# EAGLE design stm32g030c8t6 (EAGLE 9.6.1)
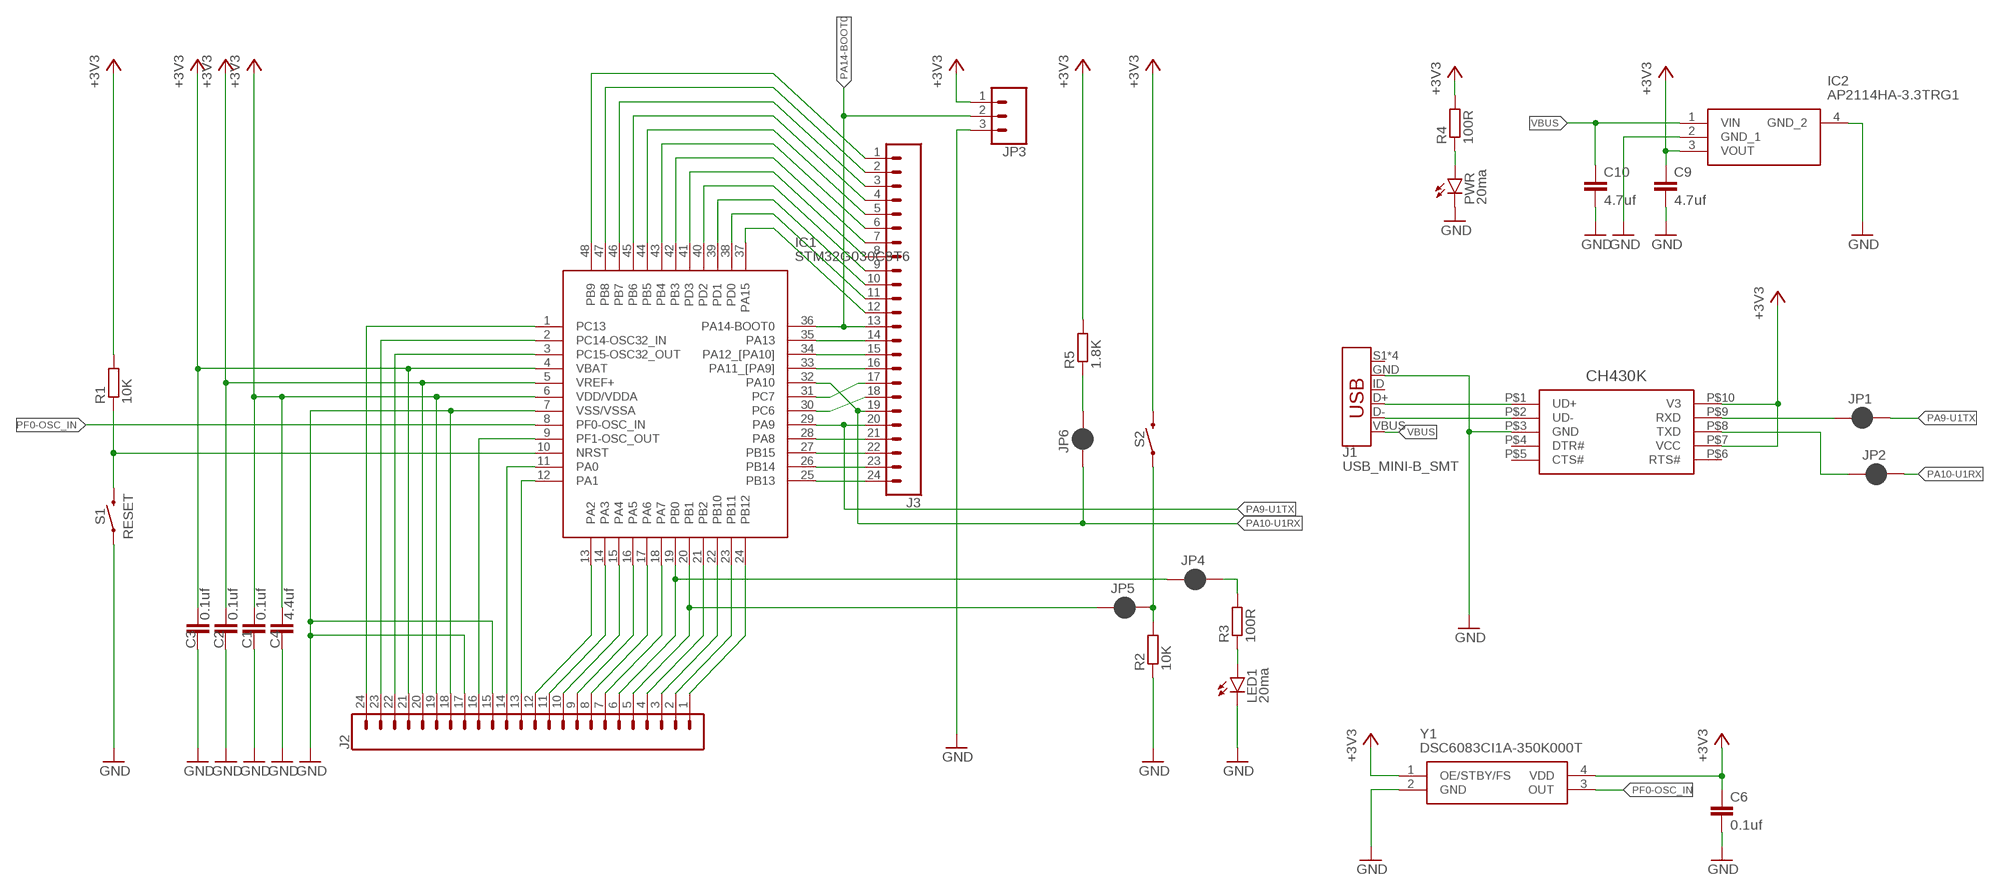
[diagram p0: schematic, sheet 1]

## Parts
C1  0.1uf  C-EUC0805  [C0805]
C2  0.1uf  C-EUC0805  [C0805]
C3  0.1uf  C-EUC0805  [C0805]
C4  4.4uf  C-EUC0805  [C0805]
C6  0.1uf  C-EUC0805  [C0805]
C9  4.7uf  C-EUC1206  [C1206]
C10  4.7uf  C-EUC1206  [C1206]
IC1  STM32G030C8T6  [QFP50P900X900X160-48N]
IC2  AP2114HA-3.3TRG1  [SOT230P700X180-4N]
J1  USB_MINI-B_SMT  [USB-MINIB]
J2  CONN_24  [1X24]
J3  CONN_24  [1X24]
JP1  JUMPER-SMT_2_NC_PASTE_SILK  [SMT-JUMPER_2_NC_PASTE_SILK]
JP2  JUMPER-SMT_2_NC_PASTE_SILK  [SMT-JUMPER_2_NC_PASTE_SILK]
JP3  455-1750-1-ND  CONN_03  [1X03]
JP4  JUMPER-SMT_2_NC_PASTE_SILK  [SMT-JUMPER_2_NC_PASTE_SILK]
JP5  JUMPER-SMT_2_NC_PASTE_SILK  [SMT-JUMPER_2_NC_PASTE_SILK]
JP6  JUMPER-SMT_2_NC_PASTE_SILK  [SMT-JUMPER_2_NC_PASTE_SILK]
LED1  20ma  LEDSML0805  [SML0805]
PWR  20ma  LEDSML0805  [SML0805]
R1  10K  R-EU_R0805  [R0805]
R2  10K  R-EU_R0805  [R0805]
R3  100R  R-EU_R0805  [R0805]
R4  100R  R-EU_R0805  [R0805]
R5  1.8K  R-EU_R0805  [R0805]
S1  RESET  MOMENTARY-SWITCH-SPST-SMD-6.0X3.5MM  [TACTILE_SWITCH_SMD_6.0X3.5MM]
S2  RESET  MOMENTARY-SWITCH-SPST-SMD-6.0X3.5MM  [TACTILE_SWITCH_SMD_6.0X3.5MM]
U$1  CH430K  [ESSOP-10]
Y1  DSC6083CI1A-350K000T  [DSC6083CI1A350K000T]

## Nets
+3V3: C1.1 C2.1 C3.1 C4.1 C6.1 C9.1 IC1.4(VBAT) IC1.5(VREF+) IC1.6(VDD/VDDA) IC2.3(VOUT) J2.19 J2.20 J2.21 JP3.1 R1.2 R4.2 R5.2 S2.2 U$1.P$7(VCC) U$1.P$10(V3) Y1.1(OE/STBY/FS) Y1.4(VDD)
A0: IC1.11(PA0) J2.14
A1: IC1.12(PA1) J2.13
A2: IC1.13(PA2) J2.12
A3: IC1.14(PA3) J2.11
A4: IC1.15(PA4) J2.10
A5: IC1.16(PA5) J2.9
A6: IC1.17(PA6) J2.8
A7: IC1.18(PA7) J2.7
B0: IC1.19(PB0) J2.6 JP4.1
B1: IC1.20(PB1) J2.5 JP5.1
B2: IC1.21(PB2) J2.4
B10: IC1.22(PB10) J2.3
B11: IC1.23(PB11) J2.2
B12: IC1.24(PB12) J2.1
GND: C1.2 C2.2 C3.2 C4.2 C6.2 C9.2 C10.2 IC1.7(VSS/VSSA) IC2.2(GND_1) IC2.4(GND_2) J1.GND J2.15 J2.17 J2.18 JP3.3 LED1.C PWR.C R2.1 S1.1 U$1.P$3(GND) Y1.2(GND)
N$1: JP6.2 R5.1
N$2 [logic]: LED1.A R3.1
N$3: JP4.2 R3.2
N$4: JP5.2 R2.2 S2.1
N$6 [logic]: PWR.A R4.1
PA8: IC1.28(PA8) J3.21
PA9-U1TX: IC1.29(PA9) J3.20 JP1.2
PA10-U1RX: IC1.32(PA10) J3.19 JP2.2 JP6.1
PA11: IC1.33(PA11_[PA9]) J3.16
PA12: IC1.34(PA12_[PA10]) J3.15
PA13: IC1.35(PA13) J3.14
PA14-BOOT0: IC1.36(PA14-BOOT0) J3.13 JP3.2
PA15: IC1.37(PA15) J3.12
PB3: IC1.42(PB3) J3.7
PB4: IC1.43(PB4) J3.6
PB5: IC1.44(PB5) J3.5
PB6: IC1.45(PB6) J3.4
PB7: IC1.46(PB7) J3.3
PB8: IC1.47(PB8) J3.2
PB9: IC1.48(PB9) J3.1
PB13: IC1.25(PB13) J3.24
PB14: IC1.26(PB14) J3.23
PB15: IC1.27(PB15) J3.22
PC6: IC1.30(PC6) J3.18
PC7: IC1.31(PC7) J3.17
PC13: IC1.1(PC13) J2.24
PC14: IC1.2(PC14-OSC32_IN) J2.23
PC15: IC1.3(PC15-OSC32_OUT) J2.22
PD0: IC1.38(PD0) J3.11
PD1: IC1.39(PD1) J3.10
PD2: IC1.40(PD2) J3.9
PD3: IC1.41(PD3) J3.8
PF0-OSC_IN: IC1.8(PF0-OSC_IN) Y1.3(OUT)
PF1: IC1.9(PF1-OSC_OUT) J2.16
PF2-NRST: IC1.10(NRST) R1.1 S1.2
RXD: JP1.1 U$1.P$9(RXD)
TXD: JP2.1 U$1.P$8(TXD)
USB_N: J1.D- U$1.P$2(UD-)
USB_P: J1.D+ U$1.P$1(UD+)
VBUS: C10.1 IC2.1(VIN) J1.VBUS
Unconnected: J1.ID J1.S1(SHIELD) J1.S2(SHIELD) J1.S3(SHIELD) J1.S4(SHIELD) U$1.P$4(DTR#) U$1.P$5(CTS#) U$1.P$6(RTS#)

## Library data of the parts
C1-C4 C6 C9 C10 = rcl:C-EU: CAPACITOR, European symbol; SPICEPREFIX: C
IC1 = STM32G030C8T6:STM32G030C8T6: ARM Microcontrollers - MCU Source: Datasheet <https://componentsearchengine.com/Datasheets/1/STM32G030C8T6.pdf>; DESCRIPTION: ARM Microcontrollers - MCU; HEIGHT: 1.6mm; MANUFACTURER_NAME: STMicroelectronics; MANUFACTURER_PART_NUMBER: STM32G030C8T6; MOUSER_PART_NUMBER: 511-STM32G030C8T6; MOUSER_PRICE-STOCK: https://www.mouser.co.uk/ProductDetail/STMicroelectronics/STM32G030C8T6?qs=uwxL4vQweFMKBA8wRRkiWA%3D%3D
IC2 = AP2114HA-3.3TRG1:AP2114HA-3.3TRG1: Linear Voltage Regulator IC Positive Fixed 1 Output 1A SOT-223-3 Source: Datasheet <https://www.diodes.com//assets/Datasheets/AP2114.pdf>; ARROW_PART_NUMBER: AP2114HA-3.3TRG1; ARROW_PRICE-STOCK: https://www.arrow.com/en/products/ap2114ha-3.3trg1/diodes-incorporated?region=asia; DESCRIPTION: Linear Voltage Regulator IC Positive Fixed 1 Output 1A SOT-223-3; HEIGHT: 1.8mm; MANUFACTURER_NAME: Diodes Incorporated; MANUFACTURER_PART_NUMBER: AP2114HA-3.3TRG1; MOUSER_PART_NUMBER: 621-AP2114HA-3.3TRG1; MOUSER_PRICE-STOCK: https://www.mouser.co.uk/ProductDetail/Diodes-Incorporated/AP2114HA-3.3TRG1?qs=M%2FOdCRO8QQ3KWhA9Gt6VoQ%3D%3D
J1 = SparkFun-Connectors:USB_MINI-B: USB type Mini-B Connector Breaks out 5th pin, and includes shield pins if needed. SparkFun Products: SparkFun FTDI Basic Breakout <https://www.sparkfun.com/products/9716> SparkFun XBee Explorer USB <https://www.sparkfun.com/products/11812> SparkFun Redboard <https://www.sparkfun.com/products/12757>; PROD_ID: CONN-08193; SF_ID: PRT-00587
J2 J3 = SparkFun-Connectors:CONN_24: Multi connection point. Often used as Generic Header-pin footprint for 0.1 inch spaced/style header connections On any of the 0.1 inch spaced packages, you can populate with these: Break Away Headers - Straight <https://www.sparkfun.com/products/116> (PRT-00116) Break Away Male Headers - Right Angle <https://www.sparkfun.com/products/553> (PRT-00553) Female Headers <https://www.sparkfun.com/products/115> (PRT-00115) Break Away Headers - Machine Pin <https://www.sparkfun.com/products/117> (PRT-00117) Break Away Female Headers - Swiss Machine Pin <https://www.sparkfun.com/products/743> (PRT-00743) For SCREWTERMINALS and SPRING TERMINALS visit here: Screw Terimnals on SparkFun.com <https://www.sparkfun.com/search/results?term=Screw+Terminals> (5mm/3.5mm/2.54mm spacing) This device is also useful as a general connection point to wire up your design to another part of your project. Our various solder wires solder well into these plated through hole pads. Hook-Up Wire - Assortment (Stranded, 22 AWG) <https://www.sparkfun.com/products/11375> (PRT-11375) Hook-Up Wire - Assortment (Solid Core, 22 AWG) <https://www.sparkfun.com/products/11367> (PRT-11367) View the entire wire category on our website here <https://www.sparkfun.com/categories/141> Special notes: Molex polarized connector foot print use with SKU : PRT-08231 with associated crimp pins and housings. 1MM SMD Version SKU: PRT-10208 NOTES ON THE VARIANTS LOCK and LOCK_LONGPADS... This footprint was designed to help hold the alignment of a through-hole component (i.e. 6-pin header) while soldering it into place. You may notice that each hole has been shifted either up or down by 0.005 of an inch from it's more standard position (which is a perfectly straight line). This slight alteration caused the pins (the squares in the middle) to touch the edges of the holes. Because they are alternating, it causes a "brace" to hold the component in place. 0.005 has proven to be the perfect amount of "off-center" position when using our standard breakaway headers. Although looks a little odd when you look at the bare footprint, once you have a header in there, the alteration is very hard to notice. Also,if you push a header all the way into place, it is covered up entirely on the bottom side.
JP1 JP2 JP4-JP6 = SparkFun-Jumpers:JUMPER-SMT_2_NC_PASTE: Normally closed solder jumper This jumper has an aperture in the stencil to allow solder paste to bridge the split in the wire so it's normally closed (NC). Wick off the solder to open the connection. Reapply solder to reclose the connection.
JP3 = SparkFun-Connectors:CONN_03: Multi connection point. Often used as Generic Header-pin footprint for 0.1 inch spaced/style header connections On any of the 0.1 inch spaced packages, you can populate with these: Break Away Headers - Straight <https://www.sparkfun.com/products/116> (PRT-00116) Break Away Male Headers - Right Angle <https://www.sparkfun.com/products/553> (PRT-00553) Female Headers <https://www.sparkfun.com/products/115> (PRT-00115) Break Away Headers - Machine Pin <https://www.sparkfun.com/products/117> (PRT-00117) Break Away Female Headers - Swiss Machine Pin <https://www.sparkfun.com/products/743> (PRT-00743) Stackable Header - 3 Pin (Female, 0.1") <https://www.sparkfun.com/products/13875> (PRT-13875) For SCREWTERMINALS and SPRING TERMINALS visit here: Screw Terimnals on SparkFun.com <https://www.sparkfun.com/search/results?term=Screw+Terminals> (5mm/3.5mm/2.54mm spacing) This device is also useful as a general connection point to wire up your design to another part of your project. Our various solder wires solder well into these plated through hole pads. Hook-Up Wire - Assortment (Stranded, 22 AWG) <https://www.sparkfun.com/products/11375> (PRT-11375) Hook-Up Wire - Assortment (Solid Core, 22 AWG) <https://www.sparkfun.com/products/11367> (PRT-11367) View the entire wire category on our website here <https://www.sparkfun.com/categories/141> Special notes: Molex polarized connector foot print use with SKU : PRT-08232 with associated crimp pins and housings.; PROD_ID: XXX-00000
LED1 PWR = led:LED: LED OSRAM: - CHIPLED LG R971, LG N971, LY N971, LG Q971, LY Q971, LO R971, LY R971 LH N974, LH R974 LS Q976, LO Q976, LY Q976 LO Q996 - Hyper CHIPLED LW Q18S LB Q993, LB Q99A, LB R99A - SideLED LS A670, LO A670, LY A670, LG A670, LP A670 LB A673, LV A673, LT A673, LW A673 LH A674 LY A675 LS A676, LA A676, LO A676, LY A676, LW A676 LS A679, LY A679, LG A679 - Hyper Micro SIDELED® LS Y876, LA Y876, LO Y876, LY Y876 LT Y87S - SmartLED LW L88C, LW L88S LB L89C, LB L89S, LG L890 LS L89K, LO L89K, LY L89K LS L896, LA L896, LO L896, LY L896 - TOPLED LS T670, LO T670, LY T670, LG T670, LP T670 LSG T670, LSP T670, LSY T670, LOP T670, LYG T670 LG T671, LOG T671, LSG T671 LB T673, LV T673, LT T673, LW T673 LH T674 LS T676, LA T676, LO T676, LY T676, LB T676, LH T676, LSB T676, LW T676 LB T67C, LV T67C, LT T67C, LS T67K, LO T67K, LY T67K, LW E67C LS E67B, LA E67B, LO E67B, LY E67B, LB E67C, LV E67C, LT E67C LW T67C LS T679, LY T679, LG T679 LS T770, LO T770, LY T770, LG T770, LP T770 LB T773, LV T773, LT T773, LW T773 LH T774 LS E675, LA E675, LY E675, LS T675 LS T776, LA T776, LO T776, LY T776, LB T776 LHGB T686 LT T68C, LB T68C - Hyper Mini TOPLED® LB M676 - Mini TOPLED Santana® LG M470 LS M47K, LO M47K, LY M47K Source: http://www.osram.convergy.de LUXEON: - LUMILED® LXK2-PW12-R00, LXK2-PW12-S00, LXK2-PW14-U00, LXK2-PW14-V00 LXK2-PM12-R00, LXK2-PM12-S00, LXK2-PM14-U00 LXK2-PE12-Q00, LXK2-PE12-R00, LXK2-PE12-S00, LXK2-PE14-T00, LXK2-PE14-U00 LXK2-PB12-K00, LXK2-PB12-L00, LXK2-PB12-M00, LXK2-PB14-N00, LXK2-PB14-P00, LXK2-PB14-Q00 LXK2-PR12-L00, LXK2-PR12-M00, LXK2-PR14-Q00, LXK2-PR14-R00 LXK2-PD12-Q00, LXK2-PD12-R00, LXK2-PD12-S00 LXK2-PH12-R00, LXK2-PH12-S00 LXK2-PL12-P00, LXK2-PL12-Q00, LXK2-PL12-R00 Source: www.luxeon.com KINGBRIGHT: KA-3528ASYC Source: www.kingbright.com
R1-R5 = rcl:R-EU_: RESISTOR, European symbol; SPICEPREFIX: R
S1 S2 = SparkFun-Switches:MOMENTARY-SWITCH-SPST: Momentary Switch (Pushbutton) - SPST Normally-open (NO) SPST momentary switches (buttons, pushbuttons). Variants PTH-12MM - 12mm square, through-hole Momentary Pushbutton Switch - 12mm Square <https://www.sparkfun.com/products/9190> (COM-09190) PTH-6.0MM, PTH-6.0MM-KIT - 6.0mm square, through-hole Mini Pushbutton Switch <https://www.sparkfun.com/products/97> (COM-00097) KIT package intended for soldering kit's - only one side of pads' copper is exposed. PTH-RIGHT-ANGLE-KIT - Right-angle, through-hole Right Angle Tactile Button <https://www.sparkfun.com/products/10791> - Used on SparkFun BigTime Watch Kit <https://www.sparkfun.com/products/11734> SMD-12MM - 12mm square, surface-mount Tactile Button - SMD (12mm) <https://www.sparkfun.com/products/12993> (COM-12993) Used on SparkFun PicoBoard <https://www.sparkfun.com/products/11888> SMD-4.5MM - 4.5mm Square Trackball Switch Used on SparkFun Blackberry Trackballer Breakout <https://www.sparkfun.com/products/13169> SMD-4.6MMX2.8MM - 4.60mm x 2.80mm, surface mount Used on SparkFun SAMD21 Mini Breakout <https://www.sparkfun.com/products/13664> SMD-5.2MM, SMD-5.2-REDUNDANT - 5.2mm square, surface-mount Mini Pushbutton Switch - SMD <https://www.sparkfun.com/products/8720> (COM-08720) Used on Arduino Pro Mini <https://www.sparkfun.com/products/11114> REDUNDANT package connects both switch circuits together SMD-6.0X3.5MM - 6.0 x 3.5mm, surface mount Momentary Reset Switch SMD <https://www.sparkfun.com/products/8229> (COM-08229) SMD-6.2MM-TALL - 6.2mm square, surface mount Tactile Button - SMD (6mm) <https://www.sparkfun.com/products/12992> Used on SparkFun Digital Sandbox <https://www.sparkfun.com/products/12651> SMD-RIGHT-ANGLE - Right-angle, surface mount Used on SparkFun Block for Intel® Edison - Arduino <https://www.sparkfun.com/products/13036>; PROD_ID: SWCH-14278; SF_SKU: COM-08229
U$1 = angelo-ch340k-nopad:CH430K: CH340K usb - uart
Y1 = angelo-DSC6083CI1A-350K000T:DSC6083CI1A-350K000T: Standard Clock Oscillators MEMS Oscillator, Ultra Low Power, LVCMOS, -40C-85C, 50ppm, 3.2x2.5mm Source: Datasheet <http://ww1.microchip.com/downloads/en/DeviceDoc/DSC60XX-Ultra-Small-Ultra-Low-Power-MEMS-Oscillator-DS20005625C.pdf>; ARROW_PART_NUMBER: DSC6083CI1A-350K000T; ARROW_PRICE-STOCK: https://www.arrow.com/en/products/dsc6083ci1a-350k000t/microchip-technology; DESCRIPTION: Standard Clock Oscillators MEMS Oscillator, Ultra Low Power, LVCMOS, -40C-85C, 50ppm, 3.2x2.5mm; HEIGHT: 0.9mm; MANUFACTURER_NAME: Microchip; MANUFACTURER_PART_NUMBER: DSC6083CI1A-350K000T; MOUSER_PART_NUMBER: 579-DSC6083CI1A350K; MOUSER_PRICE-STOCK: https://www.mouser.com/Search/Refine.aspx?Keyword=579-DSC6083CI1A350K

## Net classes
0 default: width 0.152 mm, drill 0.152 mm, clearance 0.152 mm
1 logic: width 0.152 mm, drill 0.254 mm, clearance 0.152 mm

## Board
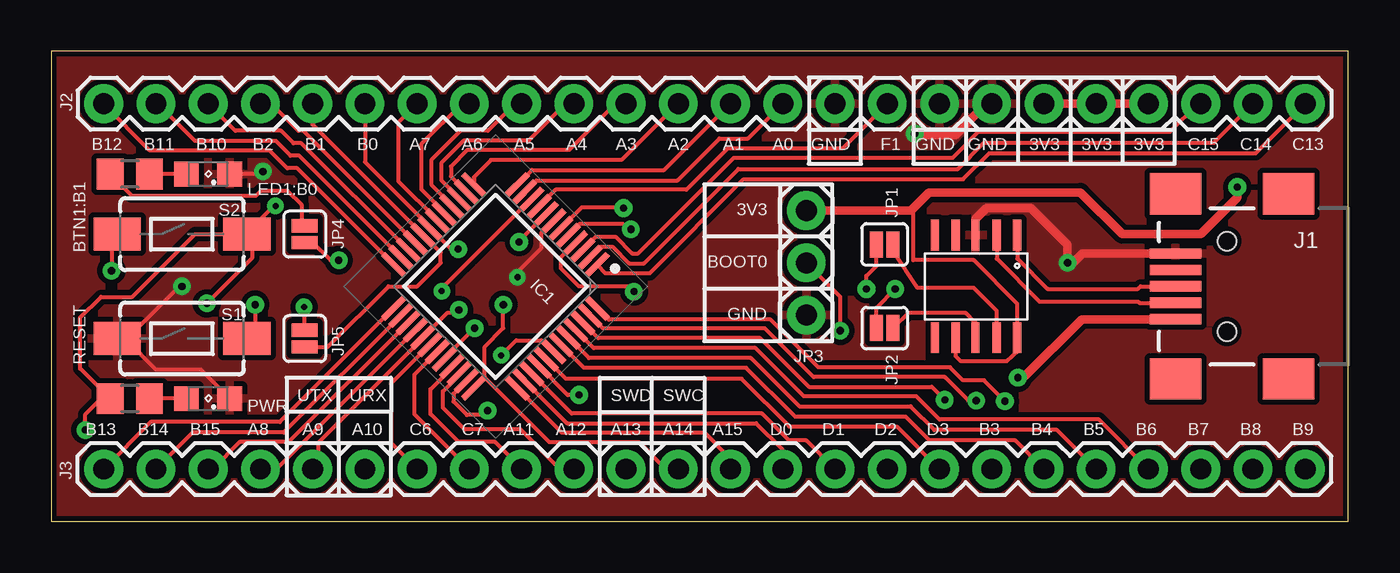
[diagram p1: board, top side]
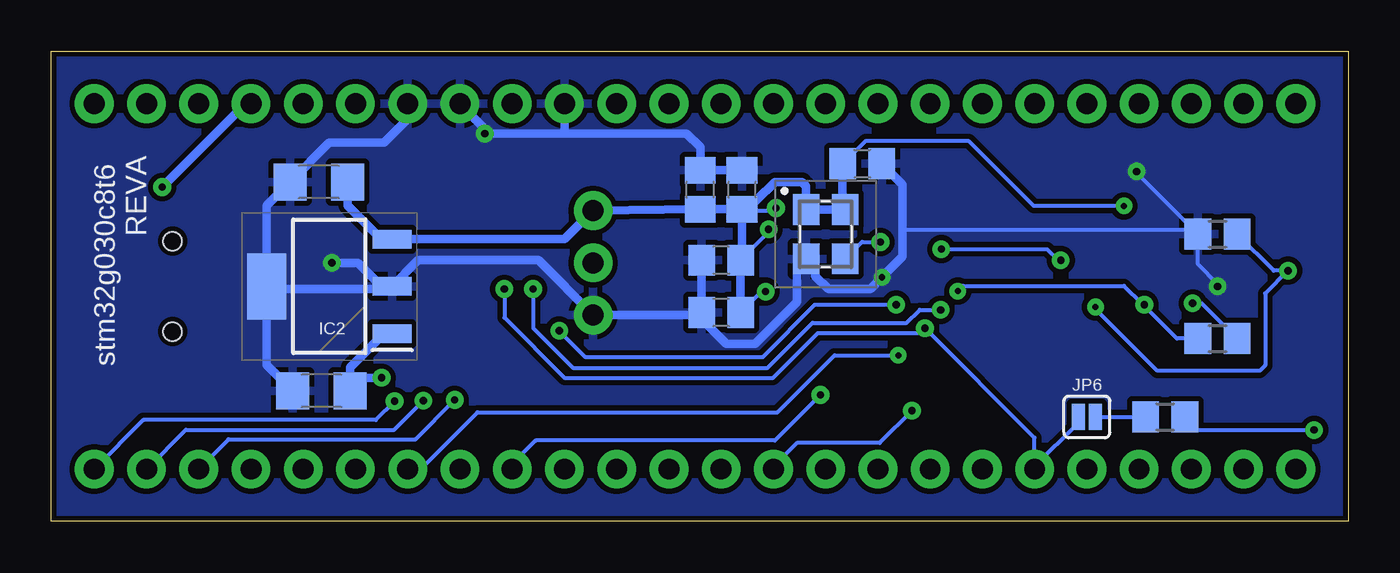
[diagram p2: board, bottom side, seen from below]

Size 63.04 x 22.86 mm. Coordinates in mm from the lower left corner, seen from the top.
Outline: 0,0 63.04,0 63.04,22.86 0,22.86 0,0
Copper layers (1*16): Top 0.035mm / dielectric 1.6mm / Bottom 0.035mm
Design rules "angelo-jlcpcb-2layers": minimum track width 8mil, minimum drill 0.3mm, track to track 6mil, track to pad 6mil, pad to pad 6mil, via to via 10mil, smd to smd 6mil, copper to edge 0.2mm, drill to drill 8mil, minimum pad ring 10mil, minimum via ring 10mil, stop-mask expansion 4mil, vias tented up to drill 0mil, thermal gap 10mil

### Footprints (pad centres in the part's own frame; a part is rotated, then mirrored left to right if it is on the bottom)
C0805 = smd 1.3 x 1.5: 1 -0.95,0; 2 0.95,0
C1206 = smd 1.6 x 1.8: 1 -1.4,0; 2 1.4,0
QFP50P900X900X160-48N = smd 1.475 x 0.3: 1 -4.238,2.75; 2 -4.238,2.25; 3 -4.238,1.75; 4 -4.238,1.25; 5 -4.238,0.75; 6 -4.238,0.25; 7 -4.238,-0.25; 8 -4.238,-0.75; 9 -4.238,-1.25; 10 -4.238,-1.75; 11 -4.238,-2.25; 12 -4.238,-2.75; 25 4.238,-2.75; 26 4.238,-2.25; 27 4.238,-1.75; 28 4.238,-1.25; 29 4.238,-0.75; 30 4.238,-0.25; 31 4.238,0.25; 32 4.238,0.75; 33 4.238,1.25; 34 4.238,1.75; 35 4.238,2.25; 36 4.238,2.75 | smd 0.3 x 1.475: 13 -2.75,-4.238; 14 -2.25,-4.238; 15 -1.75,-4.238; 16 -1.25,-4.238; 17 -0.75,-4.238; 18 -0.25,-4.238; 19 0.25,-4.238; 20 0.75,-4.238; 21 1.25,-4.238; 22 1.75,-4.238; 23 2.25,-4.238; 24 2.75,-4.238; 37 2.75,4.238; 38 2.25,4.238; 39 1.75,4.238; 40 1.25,4.238; 41 0.75,4.238; 42 0.25,4.238; 43 -0.25,4.238; 44 -0.75,4.238; 45 -1.25,4.238; 46 -1.75,4.238; 47 -2.25,4.238; 48 -2.75,4.238
SOT230P700X180-4N = smd 1.9 x 0.9: 1 -3.05,2.3; 2 -3.05,0; 3 -3.05,-2.3 | smd 1.9 x 3.2: 4 3.05,0
USB-MINIB = smd 2.5 x 0.5: D+ 2.5,0; D- 2.5,0.8; GND 2.5,-1.6; ID 2.5,-0.8; VBUS 2.5,1.6 | smd 2.5 x 2: S1 -3,4.5; S2 2.5,4.5; S3 -3,-4.5; S4 2.5,-4.5 | hole 0.9: 0,2.2; 0,-2.2
1X24 = drill 1.016 pad 1.88: 1 -26.67,0; 2 -24.13,0; 3 -21.59,0; 4 -19.05,0; 5 -16.51,0; 6 -13.97,0; 7 -11.43,0; 8 -8.89,0; 9 -6.35,0; 10 -3.81,0; 11 -1.27,0; 12 1.27,0; 13 3.81,0; 14 6.35,0; 15 8.89,0; 16 11.43,0; 17 13.97,0; 18 16.51,0; 19 19.05,0; 20 21.59,0; 21 24.13,0; 22 26.67,0; 23 29.21,0; 24 31.75,0
SMT-JUMPER_2_NC_PASTE_SILK = smd 0.635 x 1.27: 1 -0.406,0; 2 0.406,0
1X03 = drill 1.016 pad 1.88: 1 0,0; 2 2.54,0; 3 5.08,0
SML0805 = smd 1.2 x 1.2: A 1.05,0; C -1.05,0
R0805 = smd 1.3 x 1.5: 1 -0.95,0; 2 0.95,0
TACTILE_SWITCH_SMD_6.0X3.5MM = smd 2.3 x 1.6: 1 -3.15,0; 2 3.15,0
ESSOP-10 = smd 1.5 x 0.4: P$1 -2.5,2; P$2 -2.5,1; P$3 -2.5,-0.032; P$4 -2.5,-1; P$5 -2.5,-2; P$6 2.5,-2; P$7 2.5,-1; P$8 2.5,-0.032; P$9 2.5,1; P$10 2.5,2
DSC6083CI1A350K000T = smd 1.5 x 1.3: 1 1.2,0.95; 2 -1.2,0.95; 3 -1.2,-0.95; 4 1.2,-0.95

### Placement (x,y rotation side)
C1  29.46,16.13 90 bottom
C2  30.48,10.16 180 bottom
C3  30.48,12.7 180 bottom
C4  31.5,16.13 90 bottom
C6  23.62,17.4 0 bottom
C9  50.04,16.51 180 bottom
C10  49.91,6.35 180 bottom
IC1  21.59,11.43 225 top
IC2  49.53,11.43 180 bottom
J1  57.15,11.43 180 top
J2  29.21,20.32 0 top
J3  34.29,2.54 180 top
JP1  40.51,13.46 180 top
JP2  40.51,9.4 180 top
JP3  36.7,15.11 270 top
JP4  12.32,13.97 90 top
JP5  12.32,8.89 90 top
JP6  12.7,5.08 0 bottom
LED1  7.62,16.89 180 top
PWR  7.62,5.97 180 top
R1  6.35,8.89 0 bottom
R2  6.35,13.97 0 bottom
R3  3.81,16.89 180 top
R4  3.81,5.97 180 top
R5  8.89,5.08 0 bottom
S1  6.35,8.89 0 top
S2  6.35,13.97 0 top
U$1  44.96,11.43 270 top
Y1  25.4,13.97 90 bottom

### Tracks (layer width: path | path; a pad name or v marks a point on that pad's centre or on a via)
+3V3  (via drill 0.3, 0.35)
  Top 0.203: IC1.5 25.7,14.48 27.77,14.48 28.05,14.21 v28.18,14.21 | S2.2 9.75,13.72 9.75,12.8 v7.56,10.6 | U$1.P$7 43.96,8.05 44.22,7.79 46.43,7.79 46.96,8.26 U$1.P$10 46.96,10.58 44.84,12.7 41.91,12.7 41.91,15.24 | S2.2 9.5,14.03 10.81,15.34 v10.9,15.34 | IC1.6 25.78,15.27 27.79,15.27 v27.81,15.24 | IC1.4 24.77,12.84 24.77,12.32 25.65,11.43 28.07,11.43 v28.32,11.18 | S2.2 6.99,13.97 3.94,10.92 2.41,10.92 1.4,9.91 1.4,7.43 R4.2 2.41,5.97 1.65,5.21 v1.65,4.45
  Top 0.406: J2.19 J2.20 J2.21 | JP3.1 41.78,15.11 41.91,15.24 42.67,16 50.04,16 52.07,13.97 55.88,13.97 57.66,15.75 v57.66,16.26
  Bottom 0.203: v7.56,10.6 7.11,10.6 R1.2 | v10.9,15.34 15.28,15.34 18.43,18.49 23.47,18.49 24.45,17.51 C6.1 | v27.81,15.24 27.94,15.11 29.4,15.11 C1.1 | v28.32,11.18 28.51,11.18 C2.1 | v28.18,14.21 28.18,14.08 29.53,12.72 C3.1 | Y1.1 26.35,15.24 | R5.2 7.3,4.45 v1.65,4.45
  Bottom 0.406: C9.1 48.64,15.36 47,13.73 IC2.3 38.09,13.73 JP3.1 C4.1 C1.1 | C6.1 24.57,15.29 Y1.4 Y1.1 | v57.66,16.26 53.34,20.57 J2.21 | C2.1 C3.1 29.46,12.77 C1.1 | 26.35,15.24 26.35,16.32 26.54,16.51 27.88,16.51 28.31,16.07 28.32,16.07 29.21,15.18 C1.1
A0
  Top 0.203: IC1.11 23.56,16.59 30.44,16.59 32.47,18.62 33.86,18.62 J2.14
A1
  Top 0.203: J2.13 29.79,17.09 23.36,17.09 IC1.12
A2
  Top 0.203: J2.12 30.4,20.27 27.71,17.58 21.37,17.58 20.54,16.74 IC1.13
A3
  Top 0.203: J2.11 27.43,20.32 25.17,18.06 20.22,18.06 19.42,17.26 19.42,16.78 IC1.14
A4
  Top 0.203: J2.10 25.01,20.32 23.2,18.52 20.05,18.52 18.95,17.42 18.95,16.61 19.82,15.73 IC1.15
A5
  Top 0.203: IC1.16 19.47,15.38 18.47,16.38 18.47,17.57 19.9,19 21.22,19 22.49,20.27 22.85,20.27 J2.9
A6
  Top 0.203: IC1.17 19.11,15.02 17.98,16.15 17.98,18.35 19.95,20.32 J2.8
A7
  Top 0.203: IC1.18 18.76,14.67 16.87,16.56 16.87,19.41 J2.7
B0  (via drill 0.35)
  Top 0.203: J2.6 15.24,17.48 18.4,14.31 IC1.19 19.42,13.24 v19.78,13.24 | v13.97,12.7 13.56,12.7 12.7,13.56 JP4.1
  Bottom 0.203: v19.78,13.24 14.64,13.24 14.1,12.7 v13.97,12.7
B1
  Top 0.203: 18.05,13.96 IC1.20 | 18.05,13.96 12.7,19.3 J2.5 | 18.05,13.96 18.92,13.08 18.92,12.57 17.78,11.43 16.38,11.43 13.44,8.48 JP5.1
B2
  Top 0.203: J2.4 10.68,20.32 12,19 12.25,19 IC1.21
B10
  Top 0.203: IC1.22 12.15,18.4 11.77,18.4 11.17,19 8.94,19 J2.3
B11
  Top 0.203: J2.2 5.17,20.32 6.97,18.52 10.89,18.52 11.62,17.79 12.05,17.79 IC1.23
B12
  Top 0.203: J2.1 2.54,20.28 4.79,18.03 10.62,18.03 11.47,17.18 11.95,17.18 IC1.24
GND  (via drill 0.3, 0.35)
  Top 0.203: IC1.7 24.36,14.58 23.82,14.05 23.82,13.3 22.66,12.13 v22.66,11.87 | v10.29,17.02 10.16,16.89 LED1.C | v6.35,11.43 6.22,11.43 3.68,8.89 S1.1 3.58,8.89 5.11,7.37 7.27,7.37 PWR.C
  Top 0.406: J1.GND 50.11,13.03 49.66,12.57 v49.4,12.57 49.4,13.46 47.62,15.24 45.47,15.24 44.93,14.7 U$1.P$3 | v41.97,18.86 42.03,18.8 43.94,18.8 45.47,20.32 J2.18
  Bottom 0.203: 21.66,14.19 7.52,14.19 R2.1 | v10.29,17.02 10.29,16.96 R2.1 | v6.35,11.43 6.35,11.56 7.3,12.51 R2.1
  Bottom 0.406: IC2.4 52.58,15.37 C9.2 49.53,18.41 46.86,18.41 45.72,19.56 J2.18 | IC2.4 52.58,7.62 C10.2 | 46.99,11.43 IC2.2 45.21,12.7 39.37,12.7 JP3.3 31.56,10.03 C2.2 | v49.4,12.57 48.13,12.57 46.99,11.43 | IC2.4 52.45,11.3 46.86,11.3 46.99,11.43 | 38.1,18.86 v41.97,18.86 41.97,19.11 J2.17 | 38.1,18.86 32.16,18.86 31.5,18.19 C4.2 C1.2 | C6.2 21.66,16.38 21.66,14.19 21.66,12.89 22.66,11.89 v22.66,11.87 23.23,11.3 25.27,11.3 25.91,11.94 25.91,12.33 Y1.2 26.8,12.32 26.8,10.67 28.83,8.64 30.23,8.64 31.59,10 C2.2 | C2.2 C3.2 | 38.1,18.86 J2.15
  pour Bottom (isolate 0.254): 0,0 0,22.86 62.99,22.86 62.99,0
  pour Bottom (no thermals): 50.8,13.97 54.61,13.97 54.61,8.89 50.8,8.89
  pour Top (isolate 0.254): 0,0 0,22.86 63.12,22.86 63.12,0
N$1
  Bottom 0.203: JP6.2 R5.1
N$2
  Top 0.203: LED1.A R3.1
N$3
  Top 0.203: R3.2 3.9,15.85 9.95,15.85 10.2,16.1 11.46,16.1 12.16,15.4 12.16,14.38 JP4.2
N$4  (via drill 0.3, 0.35)
  Top 0.203: S2.1 2.92,13.69 v2.92,12.19 | JP5.2 12.32,10.39 v12.28,10.43
  Bottom 0.203: R2.2 3.62,12.19 v2.92,12.19 4.03,11.09 4.03,7.59 4.29,7.33 9.27,7.33 12.28,10.34 v12.28,10.43
N$6
  Top 0.203: PWR.A R4.1
PA8
  Top 0.203: IC1.28 10.93,2.54 J3.21
PA9-U1TX  (via drill 0.35)
  Top 0.203: J3.20 12.97,2.81 12.97,3.81 18.05,8.89 IC1.29 18.07,8.96 19.23,10.13 19.65,10.13 v19.81,10.29 | v39.62,11.3 39.62,11.94 40.11,12.42 JP1.2
  Bottom 0.203: v19.81,10.29 20.83,10.29 21.46,9.65 26.04,9.65 28.22,7.47 37.69,7.47 39.62,9.4 v39.62,11.3
PA10-U1RX  (via drill 0.35)
  Top 0.203: JP2.2 40.11,10.39 v41.02,11.3 | v20.57,9.4 19.12,7.95 IC1.32
  Bottom 0.203: v41.02,11.3 41.02,9.91 38.1,6.99 27.95,6.99 25.79,9.14 20.83,9.14 v20.57,9.4 15.24,4.06 J3.19 15.24,2.67 13.11,4.8 JP6.1
PA11
  Top 0.203: IC1.33 19.47,7.47 18.43,6.43 18.43,5.22 19.79,3.86 21.57,3.86 22.85,2.58 J3.16
PA12
  Top 0.203: IC1.34 19.82,7.11 19.04,6.33 19.04,5.52 20.09,4.47 22.81,4.47 24.74,2.54 J3.15
PA13  (via drill 0.35)
  Top 0.203: IC1.35 19.55,6.21 19.55,5.83 20.21,5.17 21,5.17 v21.21,5.38
  Bottom 0.203: v21.21,5.38 22.78,3.81 26.8,3.81 27.94,2.67 J3.14
PA14-BOOT0  (via drill 0.35)
  Top 0.203: v21.97,10.54 21.97,9.4 21.07,8.49 21.07,7.03 IC1.36 21.05,7 21.07,7 24.21,3.86 28.56,3.86 29.88,2.54 J3.13 | v38.35,9.27 38.35,10.92 JP3.2
  Bottom 0.203: v21.97,10.54 25.91,10.54 28.47,7.98 37.06,7.98 v38.35,9.27
PA15
  Top 0.203: IC1.37 24.81,4.32 31.75,4.32 33.02,3.05 J3.12
PB3  (via drill 0.3)
  Top 0.203: v21.87,8.08 22.59,8.8 23.82,8.8 24.36,8.27 IC1.42
  Bottom 0.203: v21.87,8.08 24.97,8.08 27.74,5.31 42.33,5.31 45.1,2.54 J3.7
PB4
  Top 0.203: IC1.43 25.91,7.47 33.78,7.47 36.15,5.1 41.53,5.1 42.69,3.94 46.86,3.94 J3.6
PB5
  Top 0.203: IC1.44 26.13,7.95 34.01,7.95 36.36,5.6 41.77,5.6 42.93,4.45 48.9,4.45 J3.5
PB6
  Top 0.203: IC1.45 26.36,8.43 34.23,8.43 36.57,6.1 42.04,6.1 43.18,4.95 50.93,4.95 J3.4
PB7  (via drill 0.35)
  Top 0.203: v43.43,5.9 42.8,6.54 36.83,6.54 34.46,8.91 26.59,8.91 IC1.46
  Bottom 0.203: J3.3 54.43,3.99 45.35,3.99 v43.43,5.9
PB8  (via drill 0.35)
  Top 0.203: v44.96,5.87 44.58,5.87 43.43,7.02 37.06,7.02 34.69,9.39 26.81,9.39 IC1.47
  Bottom 0.203: J3.2 56.51,4.45 46.38,4.45 v44.96,5.87
PB9  (via drill 0.35)
  Top 0.203: v46.35,5.84 45.34,6.86 44.32,6.86 43.69,7.49 37.29,7.49 34.97,9.82 27.09,9.82 IC1.48
  Bottom 0.203: J3.1 58.57,4.93 47.27,4.93 v46.35,5.84
PB13
  Top 0.203: IC1.25 11.1,4.83 4.83,4.83 J3.24
PB14
  Top 0.203: IC1.26 11.3,4.32 6.86,4.32 J3.23
PB15
  Top 0.203: IC1.27 11.55,3.86 9.16,3.86 7.84,2.54 J3.22
PC6
  Top 0.203: IC1.30 16.51,6.7 16.51,3.81 J3.18
PC7
  Top 0.203: J3.17 17.65,5.21 17.65,7.14 IC1.31
PC13
  Top 0.203: IC1.1 26.95,12.06 29.08,12.06 33.66,16.64 44.32,16.64 45.59,17.91 58.55,17.91 J2.24
PC14
  Top 0.203: J2.23 56.52,18.41 45.34,18.41 44.07,17.14 33.4,17.14 28.8,12.55 28.09,12.55 27.28,13.36 26.71,13.36 IC1.2
PC15
  Top 0.203: J2.22 55.75,20.32 54.38,18.95 45.07,18.95 43.82,17.69 33.19,17.69 28.52,13.03 28.24,13.03 27.42,13.85 26.49,13.85 25.83,13.19 IC1.3
PD0
  Top 0.203: J3.11 35.56,3.47 34.26,4.77 25.07,4.77 IC1.38
PD1
  Top 0.203: J3.10 36.7,3.94 35.85,3.94 34.54,5.25 25.3,5.25 IC1.39
PD2  (via drill 0.35)
  Top 0.203: v25.65,6.15 25.1,6.15 IC1.40
  Bottom 0.203: v25.65,6.15 27.87,3.94 39.5,3.94 40.64,2.79 J3.9
PD3
  Top 0.203: IC1.41 25.02,6.93 33.56,6.93 35.88,4.61 41.11,4.61 J3.8
PF0-OSC_IN  (via drill 0.35)
  Top 0.203: IC1.8 22.73,13.63 v22.73,13.59
  Bottom 0.203: v22.73,13.59 23.63,13.59 Y1.3
PF1
  Top 0.203: IC1.9 24.52,16.13 30.87,16.13 32.87,18.14 38.46,18.14 J2.16
PF2-NRST  (via drill 0.3, 0.35)
  Top 0.203: v9.91,10.54 9.91,9.3 S1.2 | v18.97,11.2 18.97,11.33 23.29,15.65 IC1.10
  Bottom 0.203: R1.1 8.32,8.89 9.91,10.48 v9.91,10.54 9.98,10.54 10.9,11.46 18.72,11.46 v18.97,11.2
RXD
  Top 0.203: JP1.1 40.92,13.14 42.11,11.35 44.84,11.35 45.96,10.24 U$1.P$9
TXD
  Top 0.203: U$1.P$8 44.93,9.66 44.45,10.13 41.66,10.13 JP2.1
USB_N
  Top 0.203: U$1.P$2 45.96,12.77 48.04,10.69 52.83,10.69 52.9,10.63 J1.D-
USB_P
  Top 0.203: U$1.P$1 46.96,12.77 48.43,11.3 52.83,11.3 52.96,11.43 J1.D+
VBUS  (via drill 0.35)
  Top 0.406: J1.VBUS 50.09,9.83 47.24,6.99 v46.99,6.99
  Bottom 0.406: IC2.1 46.88,9.13 48.51,7.5 C10.1 47.88,6.99 v46.99,6.99

### Text on the board
tNames: B12 | B11 | B10 | B2 | B1 | B0 | A7 | A6 | A5 | A4 | A3 | A2 | A1 | A0 | GND | F1 | GND | GND | 3V3 | 3V3 | 3V3 | C15 | C14 | C13 | LED1:B0 | 3V3 | BTN1:B1 | BOOT0 | GND | RESET | UTX | URX | SWD | SWC | PWR | B13 | B14 | B15 | A8 | A9 | A10 | C6 | C7 | A11 | A12 | A13 | A14 | A15 | D0 | D1 | D2 | D3 | B3 | B4 | B5 | B6 | B7 | B8 | B9
bNames: stm32g030c8t6 / REVA